# Altium schematic sheet FET Driver.SchDoc
size 431 x 279 mm; Date: Not shown in title block; ApprovedBy: Not shown in title block; CheckedBy: Not shown in title block; Author: Not shown in title block; CompanyName: Not shown in title block; Engineer: Not shown in title block; Organization: Not shown in title block; Address1: Not shown in title block; Address2: Not shown in title block; Address3: Not shown in title block; Address4: Not shown in title block; DocumentNumber: 1; Revision: Use project parameter SCH_Rev; SheetNumber: 2; SheetTotal: 3; PageSetup: Record=PageOptions|CenterHorizontal=True|CenterVertical=True|PrintScale=1.00|XCorrection=1.00|YCorrection=1.00|PrintKind=0|BorderSize=5000000|LeftOffset=0|BottomOffset=0|Orientation=2|PaperLength=1000|PaperWidth=1000|Scale=100|PaperSource=15|PrintQuality=600|MediaType=1|DitherType=10|PaperKind=Letter|PrintScaleMode=1; CurrentTime: Not shown in title block; CurrentDate: Not shown in title block; Time: Not shown in title block; DocumentFullPathAndName: Not shown in title block; DocumentName: Not shown in title block; ModifiedDate: Not shown in title block; ImagePath: Not shown in title block
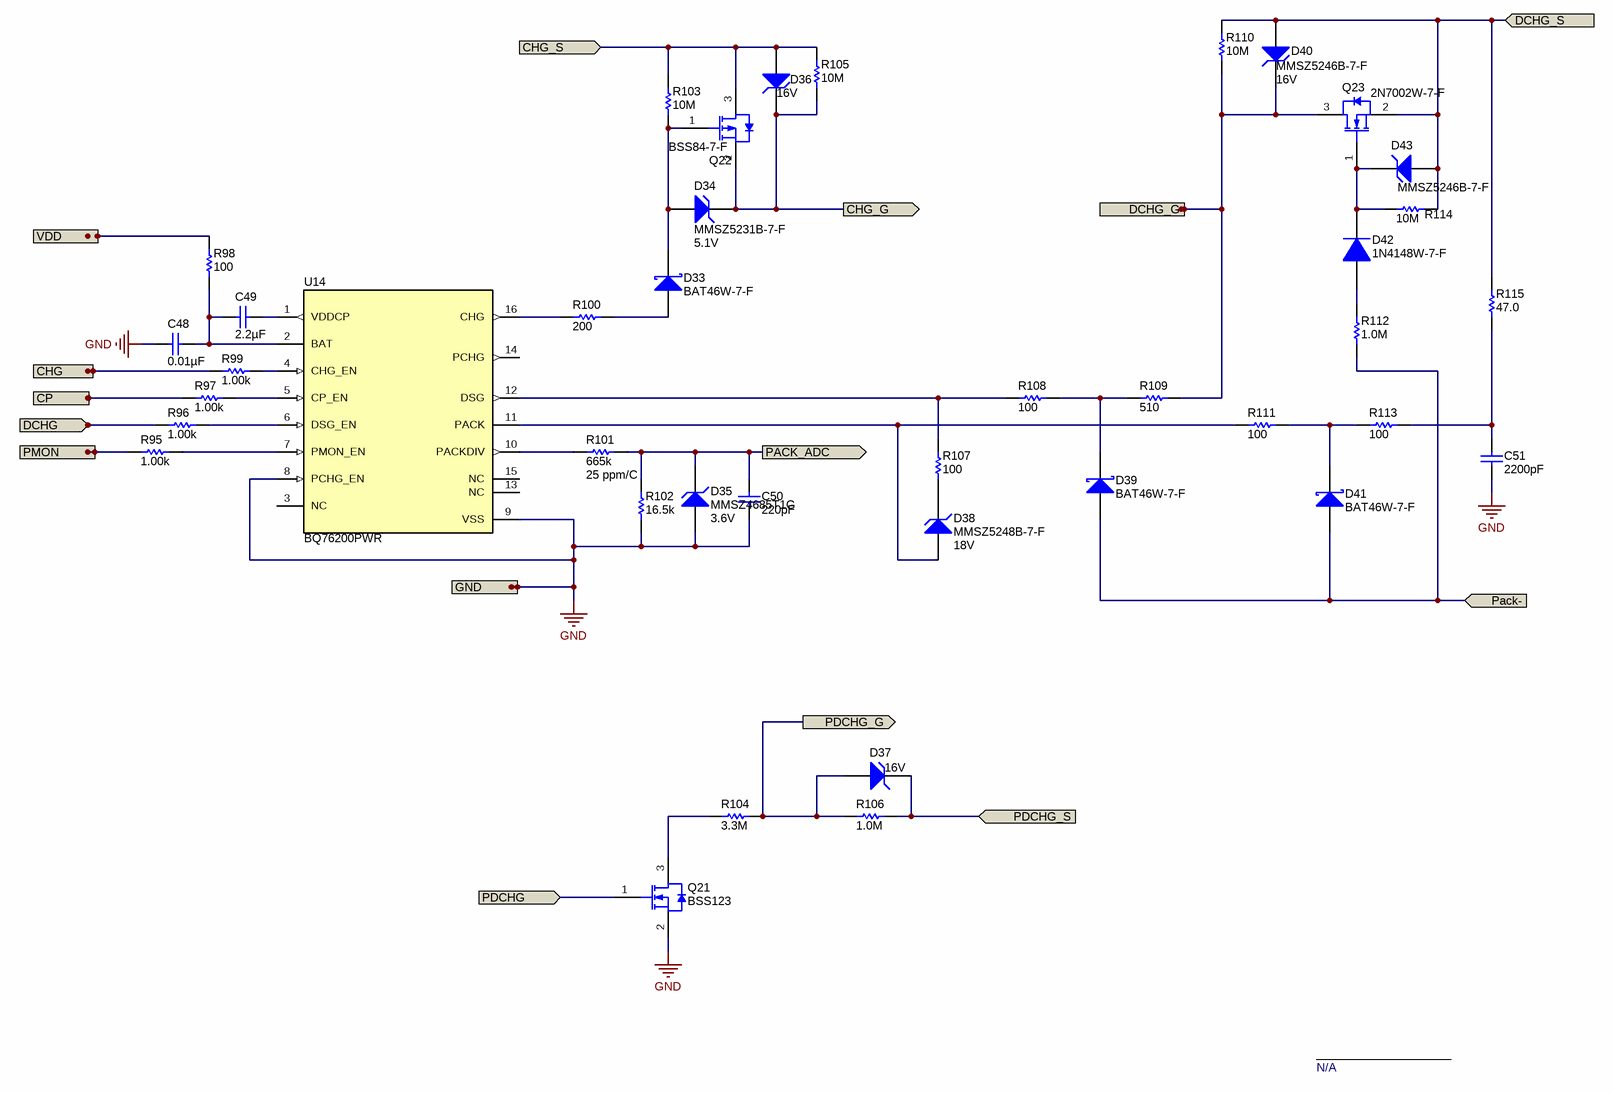
[diagram p0: FET Driver.SchDoc]

## Parts
C48  ValueDisplayed: 0.01µF  [0603]  (hidden comment: GRM188R72A103KA01D)
C49  ValueDisplayed: 2.2µF  [0805_HV]  (hidden comment: C2012X7R1V225K085AC)
C50  ValueDisplayed: 220pF  [0603]  (hidden comment: GRM188R71H221KA01D)
C51  ValueDisplayed: 2200pF  [0603]  (hidden comment: 06031C222JAT2A)
D33  BAT46W-7-F  [SOD-123]
D34  MMSZ5231B-7-F  value 5.1V  [SOD-123]
D35  MMSZ4685T1G  value 3.6V  [SOD-123]
D36  value 16V  [SOD-123]  (hidden comment: MMSZ5246B-7-F)
D37  value 16V  [SOD-123]  (hidden comment: MMSZ5246B-7-F)
D38  MMSZ5248B-7-F  value 18V  [SOD-123]
D39  BAT46W-7-F  [SOD-123]
D40  MMSZ5246B-7-F  value 16V  [SOD-123]
D41  BAT46W-7-F  [SOD-123]
D42  1N4148W-7-F  [SOD-123]
D43  MMSZ5246B-7-F  [SOD-123]
Q21  BSS123  [SOT-23]
Q22  BSS84-7-F  [SOT-23]
Q23  2N7002W-7-F  [SOT-323]
R95  ValueDisplayed: 1.00k  [0603]  (hidden comment: CRCW06031K00FKEA)
R96  ValueDisplayed: 1.00k  [0603]  (hidden comment: CRCW06031K00FKEA)
R97  ValueDisplayed: 1.00k  [0603]  (hidden comment: CRCW06031K00FKEA)
R98  ValueDisplayed: 100  [0603]  (hidden comment: CRCW0603100RFKEA)
R99  ValueDisplayed: 1.00k  [0603]  (hidden comment: CRCW06031K00FKEA)
R100  ValueDisplayed: 200  [0603]  (hidden comment: CRCW0603200RFKEA)
R101  ValueDisplayed: 665k  TempCo: 25 ppm/C  [0603]  (hidden comment: RT0603BRD07665KL)
R102  ValueDisplayed: 16.5k  [0603]  (hidden comment: RT0603BRD0716K5L)
R103  ValueDisplayed: 10M  [0603]  (hidden comment: CRCW060310M0JNEA)
R104  ValueDisplayed: 3.3M  [0603]  (hidden comment: CRCW06033M30JNEA)
R105  ValueDisplayed: 10M  [0603]  (hidden comment: CRCW060310M0JNEA)
R106  ValueDisplayed: 1.0M  [0603]  (hidden comment: CRCW06031M00JNEA)
R107  ValueDisplayed: 100  [0603]  (hidden comment: CRCW0603100RFKEA)
R108  ValueDisplayed: 100  [0603S]  (hidden comment: CRCW0603100RFKEA)
R109  ValueDisplayed: 510  [0603]  (hidden comment: CRCW0603510RJNEA)
R110  ValueDisplayed: 10M  [0603]  (hidden comment: CRCW060310M0JNEA)
R111  ValueDisplayed: 100  [0603]  (hidden comment: CRCW0603100RFKEA)
R112  ValueDisplayed: 1.0M  [0603]  (hidden comment: CRCW06031M00JNEA)
R113  ValueDisplayed: 100  [0603]  (hidden comment: CRCW0603100RFKEA)
R114  ValueDisplayed: 10M  [0603]  (hidden comment: CRCW060310M0JNEA)
R115  ValueDisplayed: 47.0  [0603]  (hidden comment: RC0603FR-0747RL)
U14  BQ76200PWR  [PW0016A_L]

## Ports
CHG (in), CHG_G (out), CHG_S (in), CP (in), DCHG (in), DCHG_G (out), DCHG_S (in), GND (in), Pack- (in), PACK_ADC (out), PDCHG (in), PDCHG_G (out), PDCHG_S (in), PMON (in), VDD (in)

## Nets
GND: C48.2 C50.2 C51.2 D35.2(A) Q21.2(S) R102.1 U14.8(PCHG_EN) U14.9(VSS) ; port GND
CHG: R99.1 ; port CHG
CHG_G: D34.1(K) D36.1(K) Q22.2(S) R105.1 ; port CHG_G
CHG_S: D36.2(A) Q22.3(D) R103.2 R105.2 ; port CHG_S
CP: R97.1 ; port CP
DCHG: R96.1 ; port DCHG
DCHG_G: D40.1(K) Q23.3(D) R109.2 R110.1 ; port DCHG_G
DCHG_S: D40.2(A) D43.2(A) Q23.2(S) R110.2 R114.1 R115.2 ; port DCHG_S
Pack-: D39.2(A) D41.2(A) R112.1 ; port Pack-
PACK_ADC: C50.1 D35.1(K) R101.2 R102.2 ; port PACK_ADC
PDCHG: Q21.1(G) ; port PDCHG
PDCHG_G: D37.2(A) R104.2 R106.1 ; port PDCHG_G
PDCHG_S: D37.1(K) R106.2 ; port PDCHG_S
PMON: R95.1 ; port PMON
VDD: R98.2 ; port VDD
NetC48_1: C48.1 C49.2 R98.1 U14.2(BAT)
NetC49_1: C49.1 U14.1(VDDCP)
NetC51_1: C51.1 R113.2 R115.1
NetD33_1: D33.1(K) D34.2(A) Q22.1(G) R103.1
NetD33_2: D33.2(A) R100.2
NetD38_1: D38.1(K) R107.1
NetD38_2: D38.2(A) R111.1 U14.11(PACK)
NetD39_1: D39.1(K) R108.2 R109.1
NetD41_1: D41.1(K) R111.2 R113.1
NetD42_1: D42.1(K) D43.1(K) Q23.1(G) R114.2
NetD42_2: D42.2(A) R112.2
NetQ21_3: Q21.3(D) R104.1
NetR95_2: R95.2 U14.7(PMON_EN)
NetR96_2: R96.2 U14.6(DSG_EN)
NetR97_2: R97.2 U14.5(CP_EN)
NetR99_2: R99.2 U14.4(CHG_EN)
NetR100_1: R100.1 U14.16(CHG)
NetR101_1: R101.1 U14.10(PACKDIV)
NetR107_2: R107.2 R108.1 U14.12(DSG)

Not connected (* = marked no-connect by the designer): U14 3(NC) 13(NC) 14(PCHG) 15(NC)

## Notes on the sheet
- N/A
- Drawn By:
- SVN Rev:
- Number:
- TID #:
- Orderable:
- Rev:
- Sheet Title:
- File:
- Project Title:
- Designed for:
- Assembly Variant:
- Mod. Date:
- Sheet:
- Size:
- of
- B
- http://www.ti.com
- Texas Instruments and/or its licensors do not warrant the accuracy or completeness of this specification or any information contained therein. Texas Instruments and/or its licensors do not warrant that this design will meet the specifications, will be suitable for your application or fit for any particular purpose, or will operate in an implementation. Texas Instruments and/or its licensors do not warrant that the design is production worthy. You should completely validate and test your design implementation to confirm the system functionality for your application.
- Engineer:
- Contact:
- © Texas Instruments

## Library data of the parts
C48 = GRM188R72A103KA01D: CAP, CERM, 0.01 µF, 100 V,+/- 10%, X7R, 0603; Manufacturer: MuRata; Polarized: N; CompType: Capacitor; Value: 0.01uF; U/M: EA; Cap_F: 0.00000001; Tolerance_%: 10; VDC_V: 100; Value2: 100V; TaMin_C: -55; TaMax_C: 125; SizeArea_mm2: 1.28; SizeAreaWB_mm2: 4.68; SizeX_mm: 1.6; SizeY_mm: 0.8; SizeZ_mm: 1; AEC Category: Q200; Green_Lifecycle: Active; Green_REACh: Passed; SymbolVersion: 2008-07-09; PartNumber: GRM188R72A103KA01D; PackageReference: 0603; RoHS: Y; MountType: SMT; Technology: Ceramic; TempCo: X7R; Cap_Case: 0603; Published: 2008-06-19; Publisher: Texas Instruments; LatestRevisionDate: 2017-06-22; ComponentLink1Description: Datasheet link; ComponentLink1URL: http://search.murata.co.jp/Ceramy/PnsearchViewAction.do?HnOFG=ON&HnNFG=ON&SEL_CNT=50&sLang=en&sKey=GRM188R72A103KA01D&x=9&y=9&search=startwith; Supplier 1: Digi-Key; Supplier Part Number 1: GRM188R72A103KA01D-ND; Supplier 2: Mouser; Supplier Part Number 2: 81-GRM188R72A103KA1D; AEC Qualified: ?; Green_EU RoHS: Passed; Green_EU RoHS-2: Incomplete
C49 = C2012X7R1V225K085AC: CAP, CERM, 2.2 µF, 35 V,+/- 10%, X7R, 0805; Manufacturer: TDK; Polarized: N; CompType: Capacitor; Value: 2.2uF; U/M: EA; Cap_F: 0.0000022; Tolerance_%: 10; VDC_V: 35; Value2: 35V; TaMin_C: -55; TaMax_C: 125; Cap_Case: 0805; SizeArea_mm2: 2.5; SizeAreaWB_mm2: 6.75; SizeX_mm: 2; SizeY_mm: 1.25; SizeZ_mm: 1.45; AEC Category: Q200; SymbolVersion: 2008-07-09; PartNumber: C2012X7R1V225K085AC; PackageReference: 0805; RoHS: Y; MountType: SMT; Technology: Ceramic; TempCo: X7R; Published: 2008-06-19; Publisher: Texas Instruments; LatestRevisionDate: 2017-06-22; ComponentLink1Description: Datasheet link; ComponentLink1URL: http://product.tdk.com/en/catalog/datasheets/mlcc_commercial_general_en.pdf; Supplier 1: Digi-Key; Supplier Part Number 1: 445-14547-1-ND; Supplier 2: Newark; Supplier Part Number 2: 52X4254; AEC Qualified: ?
C50 = GRM188R71H221KA01D: CAP, CERM, 220 pF, 50 V,+/- 10%, X7R, 0603; Manufacturer: MuRata; Polarized: N; CompType: Capacitor; Value: 220pF; U/M: EA; Cap_F: 0.00000000022; Tolerance_%: 10; VDC_V: 50; Value2: 50V; TaMin_C: -55; TaMax_C: 125; SizeArea_mm2: 1.28; SizeAreaWB_mm2: 4.68; SizeX_mm: 1.6; SizeY_mm: 0.8; SizeZ_mm: 1; AEC Category: Q200; Green_Lifecycle: Active; Green_REACh: Passed; SymbolVersion: 2008-07-09; PartNumber: GRM188R71H221KA01D; PackageReference: 0603; RoHS: Y; MountType: SMT; Technology: Ceramic; TempCo: X7R; Cap_Case: 0603; Published: 2008-06-19; Publisher: Texas Instruments; LatestRevisionDate: 2017-06-22; ComponentLink1Description: Datasheet link; ComponentLink1URL: http://search.murata.co.jp/Ceramy/PnsearchViewAction.do?HnOFG=ON&HnNFG=ON&SEL_CNT=50&sLang=en&sKey=GRM188R71H221KA01D&x=9&y=9&search=startwith; Supplier 1: Digi-Key; Supplier Part Number 1: 490-1483-1-ND; Supplier 2: Mouser; Supplier Part Number 2: 81-GRM39X221K50D; Supplier 3: Farnell; Supplier Part Number 3: 1403785; AEC Qualified: ?; Green_EU RoHS: Passed; Green_EU RoHS-2: Incomplete
C51 = 06031C222JAT2A: CAP, CERM, 2200 pF, 100 V,+/- 5%, X7R, 0603; Manufacturer: AVX; Polarized: N; CompType: Capacitor; Value: 2200pF; U/M: EA; Cap_F: 0.0000000022; Tolerance_%: 5; ESR_ohm: 0.192; Value1: 0.192 ohm; VDC_V: 100; Value2: 100V; TaMin_C: -55; TaMax_C: 125; SizeArea_mm2: 1.28; SizeAreaWB_mm2: 4.68; SizeX_mm: 1.6; SizeY_mm: 0.8; SizeZ_mm: 1; AEC Category: Q200; Green_Lifecycle: Active; Green_REACh: Passed; SymbolVersion: 2008-07-09; PartNumber: 06031C222JAT2A; PackageReference: 0603; RoHS: Y; MountType: SMT; Technology: Ceramic; TempCo: X7R; Cap_Case: 0603; Published: 2008-06-19; Publisher: Texas Instruments; LatestRevisionDate: 2017-06-22; ComponentLink1Description: Datasheet link; ComponentLink1URL: http://datasheets.avx.com/X7RDielectric.pdf; Supplier 1: Digi-Key; Supplier Part Number 1: 478-3705-1-ND; Supplier 2: Newark; Supplier Part Number 2: 96M1245; Supplier 3: Mouser; Supplier Part Number 3: 581-06031C222J; AEC Qualified: N; AEC Grade: N/A; Green_EU RoHS: Passed; Green_EU RoHS-2: Incomplete
D33 D39 D41 = BAT46W-7-F: Diode, Schottky, 100 V, 0.15 A, SOD-123; Manufacturer: Diodes Inc.; U/M: EA; Vf_V: 0.6; Value: 100V; Value1: 0.15A; Value2: 0.6V; Io_A: 0.15; Vr_V: 100; SizeAreaWB_mm2: 13.095; SizeArea_mm2: 6.545; SizeX_mm: 3.85; SizeY_mm: 1.7; SizeZ_mm: 1.35; AEC Category: Q101; Green_Lifecycle: Active; Green_REACh: Passed; CompType: Diode; SymbolVersion: 2008-12-08; PartNumber: BAT46W-7-F; PackageReference: SOD-123; MountType: SMT; Type: Schottky; RoHS: Y; Published: 2008-06-26; Publisher: Texas Instruments; LatestRevisionDate: 2017-06-26; ComponentLink1Description: Datasheet link; ComponentLink1URL: http://www.diodes.com/datasheets/ds30044.pdf; Supplier 1: Digi-Key; Supplier Part Number 1: BAT46W-7FDICT-ND; Supplier 2: Mouser; Supplier Part Number 2: 621-BAT46W-7-F; Supplier 3: Farnell; Supplier Part Number 3: 1858621; AEC Qualified: ?; Green_EU RoHS: Passed; Green_EU RoHS-2: Passed
D34 = MMSZ5231B-7-F: Diode, Zener, 5.1 V, 500 mW, SOD-123; Manufacturer: Diodes Inc.; SymbolCreator: a0412235; U/M: EA; Power_W: 0.5; Vz_V: 5.1; Value1: 0.5W; RJA_CperW: 350; SizeAreaWB_mm2: 13.095; SizeArea_mm2: 6.545; SizeX_mm: 3.85; SizeY_mm: 1.7; SizeZ_mm: 1.35; AEC Category: Q101; Green_Lifecycle: Active; Green_REACh: Passed; SymbolVersion: 2010-08-25; PartNumber: MMSZ5231B-7-F; PackageReference: SOD-123; CompType: Zener; Vr_V: N/A; MountType: SMT; RoHS: Y; ComponentLink1Description: Datasheet link; ComponentLink1URL: http://www.diodes.com/datasheets/ds18010.pdf; Published: 2008-10-08; Publisher: Texas Instruments; LatestRevisionDate: 2017-06-20; LatestRevisionNote: Updated Supplier Data; Supplier 1: Digi-Key; Supplier Part Number 1: MMSZ5231B-FDICT-ND; Supplier 2: Mouser; Supplier Part Number 2: 621-MMSZ5231B-F; Supplier 3: Farnell; Supplier Part Number 3: 1843699; AEC Qualified: ?; Green_EU RoHS: Passed; Green_EU RoHS-2: Passed
D35 = MMSZ4685T1G: Diode, Zener, 3.6 V, 500 mW, SOD-123; Manufacturer: ON Semiconductor; SymbolCreator: a0412235; U/M: EA; Power_W: 0.5; Vz_V: 3.6; Value1: 0.5W; RJA_CperW: 340; SizeAreaWB_mm2: 13.095; SizeArea_mm2: 6.545; SizeX_mm: 3.85; SizeY_mm: 1.7; SizeZ_mm: 1.35; AEC Category: Q101; Green_Lifecycle: Active; Green_REACh: Passed; SymbolVersion: 2010-08-25; PartNumber: MMSZ4685T1G; PackageReference: SOD-123; CompType: Zener; Vr_V: N/A; MountType: SMT; RoHS: Y; ComponentLink1Description: Datasheet link; ComponentLink1URL: http://www.onsemi.com/pub_link/Collateral/MMSZ4678T1-D.PDF; Published: 2008-10-08; Publisher: Texas Instruments; LatestRevisionDate: 2017-06-20; LatestRevisionNote: Updated Supplier Data; Supplier 1: Digi-Key; Supplier Part Number 1: MMSZ4685T1GOSCT-ND; Supplier 2: Mouser; Supplier Part Number 2: 863-MMSZ4685T1G; Supplier 3: Farnell; Supplier Part Number 3: 1651592; AEC Qualified: ?; Green_EU RoHS: Passed; Green_EU RoHS-2: Passed
D36 D37 D40 = MMSZ5246B-7-F: Diode, Zener, 16 V, 500 mW, SOD-123; Manufacturer: Diodes Inc.; SymbolCreator: a0412235; U/M: EA; Power_W: 0.5; Vz_V: 16; Value1: 0.5W; RJA_CperW: 350; SizeAreaWB_mm2: 13.095; SizeArea_mm2: 6.545; SizeX_mm: 3.85; SizeY_mm: 1.7; SizeZ_mm: 1.35; AEC Category: Q101; Green_Lifecycle: Active; Green_REACh: Passed; SymbolVersion: 2010-08-25; PartNumber: MMSZ5246B-7-F; PackageReference: SOD-123; CompType: Zener; Vr_V: N/A; MountType: SMT; RoHS: Y; ComponentLink1Description: Datasheet link; ComponentLink1URL: http://www.diodes.com/datasheets/ds18010.pdf; Published: 2008-10-08; Publisher: Texas Instruments; LatestRevisionDate: 2017-06-20; LatestRevisionNote: Updated Supplier Data; Supplier 1: Digi-Key; Supplier Part Number 1: MMSZ5246B-FDICT-ND; Supplier 2: Mouser; Supplier Part Number 2: 621-MMSZ5246B-F; Supplier 3: Farnell; Supplier Part Number 3: 2061482; AEC Qualified: ?; Green_EU RoHS: Passed; Green_EU RoHS-2: Passed
D38 = MMSZ5248B-7-F: Diode, Zener, 18 V, 500 mW, SOD-123; Manufacturer: Diodes Inc.; SymbolCreator: a0412235; U/M: EA; Power_W: 0.5; Vz_V: 18; Value1: 0.5W; RJA_CperW: 350; SizeAreaWB_mm2: 13.095; SizeArea_mm2: 6.545; SizeX_mm: 3.85; SizeY_mm: 1.7; SizeZ_mm: 1.35; AEC Category: Q101; Green_Lifecycle: Active; Green_REACh: Passed; SymbolVersion: 2010-08-25; PartNumber: MMSZ5248B-7-F; PackageReference: SOD-123; CompType: Zener; Vr_V: N/A; MountType: SMT; RoHS: Y; ComponentLink1Description: Datasheet link; ComponentLink1URL: http://www.diodes.com/datasheets/ds18010.pdf; Published: 2008-10-08; Publisher: Texas Instruments; LatestRevisionDate: 2017-06-20; LatestRevisionNote: Updated Supplier Data; Supplier 1: Digi-Key; Supplier Part Number 1: MMSZ5248B-FDICT-ND; Supplier 2: Mouser; Supplier Part Number 2: 621-MMSZ5248B-F; Supplier 3: Farnell; Supplier Part Number 3: 2061483; AEC Qualified: ?; Green_EU RoHS: Passed; Green_EU RoHS-2: Passed
D42 = 1N4148W-7-F: Diode, Ultrafast, 100 V, 0.15 A, SOD-123; Manufacturer: Diodes Inc.; U/M: EA; Vf_V: 1.25; Value: 100V; Value1: 0.15A; Value2: 1.25V; Io_A: 0.15; Vr_V: 100; TJmax_C: 150; SizeAreaWB_mm2: 13.095; SizeArea_mm2: 6.545; SizeX_mm: 3.85; SizeY_mm: 1.7; SizeZ_mm: 1.35; AEC Category: Q101; Green_Lifecycle: Active; Green_REACh: Passed; SymbolVersion: 2008-12-08; PartNumber: 1N4148W-7-F; PackageReference: SOD-123; CompType: Diode; MountType: SMT; Type: Ultrafast; RoHS: Y; Published: 2008-06-26; Publisher: Texas Instruments; LatestRevisionDate: 2017-06-26; ComponentLink1Description: Datasheet link; ComponentLink1URL: http://www.diodes.com/datasheets/ds30086.pdf; Supplier 1: Digi-Key; Supplier Part Number 1: 1N4148W-FDICT-ND; Supplier 2: Mouser; Supplier Part Number 2: 621-1N4148W-F; Supplier 3: Farnell; Supplier Part Number 3: 1776392; AEC Qualified: ?; Green_EU RoHS: Passed; Green_EU RoHS-2: Passed
D43 = MMSZ5246B-7-F: Diode, Zener, 16 V, 500 mW, SOD-123; Manufacturer: Diodes Inc.; SymbolCreator: a0412235; Value: 16V; U/M: EA; Power_W: 0.5; Vz_V: 16; Value1: 0.5W; RJA_CperW: 350; SizeAreaWB_mm2: 13.095; SizeArea_mm2: 6.545; SizeX_mm: 3.85; SizeY_mm: 1.7; SizeZ_mm: 1.35; AEC Category: Q101; Green_Lifecycle: Active; Green_REACh: Passed; SymbolVersion: 2010-08-25; PartNumber: MMSZ5246B-7-F; PackageReference: SOD-123; CompType: Zener; Vr_V: N/A; MountType: SMT; RoHS: Y; ComponentLink1Description: Datasheet link; ComponentLink1URL: http://www.diodes.com/datasheets/ds18010.pdf; Published: 2008-10-08; Publisher: Texas Instruments; LatestRevisionDate: 2017-06-20; LatestRevisionNote: Updated Supplier Data; Supplier 1: Digi-Key; Supplier Part Number 1: MMSZ5246B-FDICT-ND; Supplier 2: Mouser; Supplier Part Number 2: 621-MMSZ5246B-F; Supplier 3: Farnell; Supplier Part Number 3: 2061482; AEC Qualified: ?; Green_EU RoHS: Passed; Green_EU RoHS-2: Passed
Q21 = BSS123: MOSFET, N-CH, 100 V, 0.17 A, SOT-23; Manufacturer: Fairchild Semiconductor; Alternate Manufacturer: None; U/M: EA; ChType: N; Value: 100V; VdsMax_V: 100; Value1: 10 ohm; Rdson45_ohm: 10; Value2: 1.8 nC; QgTyp_nC: 1.8; Vgs_V: 20; IdsMax_A: 0.17; SizeAreaWB_mm2: 14; SizeArea_mm2: 7.5; SizeX_mm: 2.5; SizeY_mm: 3; SizeZ_mm: 1.1; AEC Category: Q101; Green_Lifecycle: Active; Green_REACh: Passed; SymbolVersion: 2008-07-28; CompType: MOSFET; PartNumber: BSS123; PackageReference: SOT-23; RoHS: Y; MountType: SMT; Published: 2008-06-19; Publisher: Texas Instruments; LatestRevisionDate: 2017-06-26; LatestRevisionNote: Added parts.; ComponentLink1Description: Datasheet link; ComponentLink1URL: http://www.fairchildsemi.com/ds/BS/BSS123.pdf; Supplier 1: Digi-Key; Supplier Part Number 1: BSS123NCT-ND; Supplier 2: Newark; Supplier Part Number 2: 58K8768; Supplier 3: Mouser; Supplier Part Number 3: 512-BSS123; AEC Qualified: ?; Green_EU RoHS: Passed; Green_EU RoHS-2: Passed
Q22 = BSS84-7-F: MOSFET, P-CH, -50 V, -0.13 A, SOT-23; Manufacturer: Diodes Inc.; Alternate Manufacturer: None; U/M: EA; ChType: P; Value: -50V; Value1: ? ohm; Value2: ? nC; Vgs_V: -20; SizeAreaWB_mm2: 14; SizeArea_mm2: 7.5; SizeX_mm: 2.5; SizeY_mm: 3; SizeZ_mm: 1.1; AEC Category: Q101; AEC Qualified: N; Green_Lifecycle: Active; Green_REACh: Passed; SymbolVersion: 2008-07-09; PartNumber: BSS84-7-F; PackageReference: SOT-23; CompType: MOSFET; VdsMax_V: -50; IdsMax_A: -0.13; RoHS: Y; MountType: SMT; Published: 2008-06-19; Publisher: Texas Instruments; LatestRevisionDate: 2017-06-26; LatestRevisionNote: Added parts.; ComponentLink1Description: Datasheet link; ComponentLink1URL: http://www.diodes.com/datasheets/ds30149.pdf; Supplier 1: Digi-Key; Supplier Part Number 1: BSS84-FDICT-ND; Supplier 2: Newark; Supplier Part Number 2: 12T1443; Supplier 3: Mouser; Supplier Part Number 3: 621-BSS84-F; Green_EU RoHS: Passed; Green_EU RoHS-2: Passed
Q23 = 2N7002W-7-F: MOSFET, N-CH, 60 V, 0.115 A, SOT-323; Manufacturer: Diodes Inc.; Alternate Manufacturer: None; U/M: EA; ChType: N; Value: 60V; VdsMax_V: 60; Value1: 7.5 ohm; Rdson45_ohm: 7.5; Value2: ? nC; Vgs_V: 20; IdsMax_A: 0.115; SizeAreaWB_mm2: 10.24; SizeArea_mm2: 4.84; SizeX_mm: 2.2; SizeZ_mm: 1.1; AEC Category: Q101; Green_Lifecycle: Active; Green_REACh: Passed; SymbolVersion: 2008-07-28; CompType: MOSFET; PartNumber: 2N7002W-7-F; PackageReference: SOT-323; SizeY_mm: 2.2; RoHS: Y; MountType: SMT; Published: 2008-06-19; Publisher: Texas Instruments; LatestRevisionDate: 2017-06-26; LatestRevisionNote: Added parts.; ComponentLink1Description: Datasheet link; ComponentLink1URL: http://www.diodes.com/datasheets/ds30099.pdf; Supplier 1: Digi-Key; Supplier Part Number 1: 2N7002W-FDICT-ND; Supplier 2: Newark; Supplier Part Number 2: 25R5685; Supplier 3: Mouser; Supplier Part Number 3: 621-2N7002W-F; AEC Qualified: ?; Green_EU RoHS: Passed; Green_EU RoHS-2: Passed
R95-R97 R99 = CRCW06031K00FKEA: RES, 1.00 k, 1%, 0.1 W, 0603; Manufacturer: Vishay-Dale; CompType: Resistor; Value: 1.00k; Res_ohm: 1000; Value_Code: 1k00; Tolerance_%: 1; Power_W: 0.1; Value2: 0.1W; VDC_V: 75; TempCo: 100 ppm/C; SizeArea_mm2: 1.28; SizeX_mm: 1.6; SizeY_mm: 0.8; EIA_Code: E96; U/M: EA; AEC Category: Q200; Green_Lifecycle: Active; Green_REACh: Passed; SymbolVersion: 2009-05-29; PartNumber: CRCW06031K00FKEA; PackageReference: 0603; RoHS: Y; Value1: 1%; MountType: SMT; Technology: Thick Film; SizeZ_mm: 1; Published: 2008-06-26; Publisher: Texas Instruments; LatestRevisionDate: 2017-06-13; ComponentLink1Description: Datasheet link; ComponentLink1URL: http://www.vishay.com/docs/20035/dcrcwe3.pdf; Supplier 1: Digi-Key; Supplier Part Number 1: 541-1.00KHCT-ND; Supplier 2: Newark; Supplier Part Number 2: 52K8015; Supplier 3: Mouser; Supplier Part Number 3: 71-CRCW0603-1.0K-E3; AEC Qualified: ?; Green_EU RoHS: Passed with Exemption; Green_EU RoHS-2: Passed
R98 R107 R108 R111 R113 = CRCW0603100RFKEA: RES, 100, 1%, 0.1 W, 0603; Manufacturer: Vishay-Dale; CompType: Resistor; Value: 100; Value_Code: 100R; Tolerance_%: 1; Power_W: 0.1; Value2: 0.1W; VDC_V: 75; TempCo: 100 ppm/C; SizeArea_mm2: 1.28; SizeX_mm: 1.6; SizeY_mm: 0.8; EIA_Code: E96; U/M: EA; AEC Category: Q200; Green_Lifecycle: Active; Green_REACh: Passed; SymbolVersion: 2009-05-29; PartNumber: CRCW0603100RFKEA; PackageReference: 0603; RoHS: Y; Res_ohm: 100; Value1: 1%; MountType: SMT; Technology: Thick Film; SizeZ_mm: 1; Published: 2008-06-26; Publisher: Texas Instruments; LatestRevisionDate: 2017-06-13; ComponentLink1Description: Datasheet link; ComponentLink1URL: http://www.vishay.com/docs/20035/dcrcwe3.pdf; Supplier 1: Digi-Key; Supplier Part Number 1: 541-100HCT-ND; Supplier 2: Newark; Supplier Part Number 2: 52K8078; Supplier 3: Mouser; Supplier Part Number 3: 71-CRCW0603-100-E3; AEC Qualified: ?; Green_EU RoHS: Passed with Exemption; Green_EU RoHS-2: Passed
R100 = CRCW0603200RFKEA: RES, 200, 1%, 0.1 W, 0603; Manufacturer: Vishay-Dale; CompType: Resistor; Value: 200; Value_Code: 200R; Tolerance_%: 1; Power_W: 0.1; Value2: 0.1W; VDC_V: 75; TempCo: 100 ppm/C; SizeArea_mm2: 1.28; SizeX_mm: 1.6; SizeY_mm: 0.8; EIA_Code: E96; U/M: EA; AEC Category: Q200; Green_Lifecycle: Active; Green_REACh: Passed; SymbolVersion: 2009-05-29; PartNumber: CRCW0603200RFKEA; PackageReference: 0603; RoHS: Y; Res_ohm: 200; Value1: 1%; MountType: SMT; Technology: Thick Film; SizeZ_mm: 1; Published: 2008-06-26; Publisher: Texas Instruments; LatestRevisionDate: 2017-06-13; ComponentLink1Description: Datasheet link; ComponentLink1URL: http://www.vishay.com/docs/20035/dcrcwe3.pdf; Supplier 1: Digi-Key; Supplier Part Number 1: 541-200HCT-ND; Supplier 2: Newark; Supplier Part Number 2: 52K8273; Supplier 3: Mouser; Supplier Part Number 3: 71-CRCW0603-200-E3; AEC Qualified: ?; Green_EU RoHS: Passed with Exemption; Green_EU RoHS-2: Passed
R101 = RT0603BRD07665KL: RES, 665 k, 0.1%, 0.1 W, 0603; Manufacturer: Yageo America; CompType: Resistor; Value: 665k; Res_ohm: 665000; Tolerance_%: 0.1; Value2: 0.1W; VDC_V: 75; SizeArea_mm2: 1.28; SizeX_mm: 1.6; SizeY_mm: 0.8; SizeZ_mm: 1; EIA_Code: E192; U/M: EA; AEC Category: Q200; SymbolVersion: 2009-05-29; PartNumber: RT0603BRD07665KL; PackageReference: 0603; RoHS: Y; Value_Code: 665k; Value1: 0.1%; Power_W: 0.1; MountType: SMT; Technology: Thin Film; Published: 2008-06-26; Publisher: Texas Instruments; LatestRevisionDate: 2017-06-13; ComponentLink1Description: Datasheet link; ComponentLink1URL: http://www.yageo.com/pdf/PYu-RT_1-to-0.05_RoHS_L_3.pdf; AEC Qualified: ?
R102 = RT0603BRD0716K5L: RES, 16.5 k, 0.1%, 0.1 W, 0603; Manufacturer: Yageo America; CompType: Resistor; Value: 16.5k; Res_ohm: 16500; Value_Code: 16k5; Tolerance_%: 0.1; Value2: 0.1W; VDC_V: 75; TempCo: 25 ppm/C; SizeArea_mm2: 1.28; SizeX_mm: 1.6; SizeY_mm: 0.8; SizeZ_mm: 1; EIA_Code: E192; U/M: EA; AEC Category: Q200; SymbolVersion: 2009-05-29; PartNumber: RT0603BRD0716K5L; PackageReference: 0603; RoHS: Y; Value1: 0.1%; Power_W: 0.1; MountType: SMT; Technology: Thin Film; Published: 2008-06-26; Publisher: Texas Instruments; LatestRevisionDate: 2017-06-13; ComponentLink1Description: Datasheet link; ComponentLink1URL: http://www.yageo.com/pdf/PYu-RT_1-to-0.05_RoHS_L_3.pdf; AEC Qualified: ?
R103 R105 R110 R114 = CRCW060310M0JNEA: RES, 10 M, 5%, 0.1 W, 0603; Manufacturer: Vishay-Dale; CompType: Resistor; Value: 10Meg; Res_ohm: 10000000; Value_Code: 10M0; Tolerance_%: 5; Power_W: 0.1; Value2: 0.1W; VDC_V: 75; TempCo: 200 ppm/C; SizeArea_mm2: 1.28; SizeX_mm: 1.6; SizeY_mm: 0.8; SizeZ_mm: 1; EIA_Code: E24; U/M: EA; AEC Category: Q200; Green_Lifecycle: Active; Green_REACh: Passed; SymbolVersion: 2009-05-29; PartNumber: CRCW060310M0JNEA; PackageReference: 0603; RoHS: Y; Value1: 5%; MountType: SMT; Technology: Thick Film; Published: 2008-06-26; Publisher: Texas Instruments; LatestRevisionDate: 2017-06-13; ComponentLink1Description: Datasheet link; ComponentLink1URL: http://www.vishay.com/docs/20035/dcrcwe3.pdf; Supplier 1: Digi-Key; Supplier Part Number 1: 541-10MGCT-ND; Supplier 2: Newark; Supplier Part Number 2: 59M6761; Supplier 3: Mouser; Supplier Part Number 3: 71-CRCW0603J-10M-E3; AEC Qualified: ?; Green_EU RoHS: Passed with Exemption; Green_EU RoHS-2: Passed
R104 = CRCW06033M30JNEA: RES, 3.3 M, 5%, 0.1 W, 0603; Manufacturer: Vishay-Dale; CompType: Resistor; Value: 3.3Meg; Res_ohm: 3300000; Value_Code: 3M30; Tolerance_%: 5; Power_W: 0.1; Value2: 0.1W; VDC_V: 75; TempCo: 200 ppm/C; SizeArea_mm2: 1.28; SizeX_mm: 1.6; SizeY_mm: 0.8; SizeZ_mm: 1; EIA_Code: E24; U/M: EA; AEC Category: Q200; Green_Lifecycle: Active; Green_REACh: Passed; SymbolVersion: 2009-05-29; PartNumber: CRCW06033M30JNEA; PackageReference: 0603; RoHS: Y; Value1: 5%; MountType: SMT; Technology: Thick Film; Published: 2008-06-26; Publisher: Texas Instruments; LatestRevisionDate: 2017-06-13; ComponentLink1Description: Datasheet link; ComponentLink1URL: http://www.vishay.com/docs/20035/dcrcwe3.pdf; Supplier 1: Digi-Key; Supplier Part Number 1: 541-3.3MGCT-ND; Supplier 2: Mouser; Supplier Part Number 2: 71-CRCW0603J-3.3M-E3; AEC Qualified: ?; Green_EU RoHS: Passed with Exemption; Green_EU RoHS-2: Passed
R106 R112 = CRCW06031M00JNEA: RES, 1.0 M, 5%, 0.1 W, 0603; Manufacturer: Vishay-Dale; CompType: Resistor; Value: 1.0Meg; Res_ohm: 1000000; Value_Code: 1M00; Tolerance_%: 5; Power_W: 0.1; Value2: 0.1W; VDC_V: 75; TempCo: 200 ppm/C; SizeArea_mm2: 1.28; SizeX_mm: 1.6; SizeY_mm: 0.8; SizeZ_mm: 1; EIA_Code: E24; U/M: EA; AEC Category: Q200; Green_Lifecycle: Active; Green_REACh: Passed; SymbolVersion: 2009-05-29; PartNumber: CRCW06031M00JNEA; PackageReference: 0603; RoHS: Y; Value1: 5%; MountType: SMT; Technology: Thick Film; Published: 2008-06-26; Publisher: Texas Instruments; LatestRevisionDate: 2017-06-13; ComponentLink1Description: Datasheet link; ComponentLink1URL: http://www.vishay.com/docs/20035/dcrcwe3.pdf; Supplier 1: Digi-Key; Supplier Part Number 1: 541-1.0MGCT-ND; Supplier 2: Newark; Supplier Part Number 2: 59M6756; Supplier 3: Mouser; Supplier Part Number 3: 71-CRCW0603J-1.0M-E3; AEC Qualified: ?; Green_EU RoHS: Passed with Exemption; Green_EU RoHS-2: Passed
R109 = CRCW0603510RJNEA: RES, 510, 5%, 0.1 W, 0603; Manufacturer: Vishay-Dale; CompType: Resistor; Value: 510; Value_Code: 510R; Tolerance_%: 5; Power_W: 0.1; Value2: 0.1W; VDC_V: 75; TempCo: 200 ppm/C; SizeArea_mm2: 1.28; SizeX_mm: 1.6; SizeY_mm: 0.8; SizeZ_mm: 1; EIA_Code: E24; U/M: EA; AEC Category: Q200; Green_Lifecycle: Active; Green_REACh: Passed; SymbolVersion: 2009-05-29; PartNumber: CRCW0603510RJNEA; PackageReference: 0603; RoHS: Y; Res_ohm: 510; Value1: 5%; MountType: SMT; Technology: Thick Film; Published: 2008-06-26; Publisher: Texas Instruments; LatestRevisionDate: 2017-06-13; ComponentLink1Description: Datasheet link; ComponentLink1URL: http://www.vishay.com/docs/20035/dcrcwe3.pdf; Supplier 1: Digi-Key; Supplier Part Number 1: 541-510GCT-ND; Supplier 2: Newark; Supplier Part Number 2: 59M6823; Supplier 3: Mouser; Supplier Part Number 3: 71-CRCW0603J-510-E3; AEC Qualified: ?; Green_EU RoHS: Passed with Exemption; Green_EU RoHS-2: Passed
R115 = RC0603FR-0747RL: RES, 47.0, 1%, 0.1 W, 0603; Manufacturer: Yageo America; CompType: Resistor; Value: 47.0; Res_ohm: 47; Value_Code: 47R0; Tolerance_%: 1; Power_W: 0.1; Value2: 0.1W; VDC_V: 150; TempCo: 200 ppm/C; SizeArea_mm2: 1.28; SizeX_mm: 1.6; SizeY_mm: 0.8; U/M: EA; AEC Category: Q200; Green_Lifecycle: Active; Green_REACh: Passed; SymbolVersion: 2009-05-29; PartNumber: RC0603FR-0747RL; PackageReference: 0603; RoHS: Y; Value1: 1%; MountType: SMT; Technology: Thick Film; SizeZ_mm: 1; Published: 2008-06-26; Publisher: Texas Instruments; LatestRevisionDate: 2017-06-13; ComponentLink1Description: Datasheet link; ComponentLink1URL: http://www.yageo.com/pdf/Pu-RC0603_51_PbFree_L_2.pdf; Supplier 1: Digi-Key; Supplier Part Number 1: 311-47.0HRCT-ND; Supplier 2: Mouser; Supplier Part Number 2: 603-RC0603FR-0747RL; Supplier 3: Farnell; Supplier Part Number 3: 9238328; AEC Qualified: ?; Green_EU RoHS: Passed with Exemption; Green_EU RoHS-2: Passed
U14 = CMP-0076175-1: High-Side N-Channel FET Driver, PW0016A (TSSOP-16); Manufacturer: Texas Instruments; SizeAreaWB_mm2: 58.8; SizeArea_mm2: 32.0; SizeZ_mm: 1.2; SizeY_mm: 5.0; U/M: EA; CompType: IC; SizeX_mm: 6.4; ComponentLink1Description: Datasheet Link; RoHS: Y; PackageReference: PW0016A; PartNumber: BQ76200PWR; Publisher: Texas Instruments; PackageDescription: TSSOP-16; Alternate Manufacturer: Texas Instruments; ComponentLink1URL: http://www.ti.com/lit/ds/symlink/bq76200.pdf; LatestRevisionDate: 2017-06-09; Alternate PartNumber: BQ76200PW; MountType: SMT